# EAGLE design DIY_tool_-_button_panel_v1 (EAGLE 8.0.0)
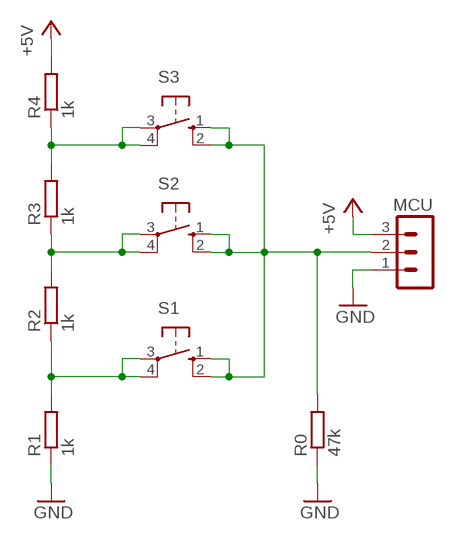
[diagram p0: schematic, sheet 1]

## Parts
MCU  MA03-1  [MA03-1]
R0  47k  R-EU_0207/10  [0207/10]
R1  1k  R-EU_0207/10  [0207/10]
R2  1k  R-EU_0207/10  [0207/10]
R3  1k  R-EU_0207/10  [0207/10]
R4  1k  R-EU_0207/10  [0207/10]
S1  10-XX  [B3F-10XX]
S2  10-XX  [B3F-10XX]
S3  10-XX  [B3F-10XX]

## Nets
+5V: MCU.3 R4.2
ADC: MCU.2 R0.2 S1.1(S) S1.2(S1) S2.1(S) S2.2(S1) S3.1(S) S3.2(S1)
B1: R1.2 R2.1 S1.3(P) S1.4(P1)
B2: R2.2 R3.1 S2.3(P) S2.4(P1)
B3: R3.2 R4.1 S3.3(P) S3.4(P1)
GND: MCU.1 R0.1 R1.1

## Library data of the parts
MCU = con-lstb:MA03-1: PIN HEADER; OC_FARNELL: unknown; OC_NEWARK: unknown
R0 R1-R4 = rcl:R-EU_: RESISTOR, European symbol
S1-S3 = switch-omron:10-XX: OMRON SWITCH; MPN: B3F-1000; OC_FARNELL: 176432; OC_NEWARK: 36M3542

## Board
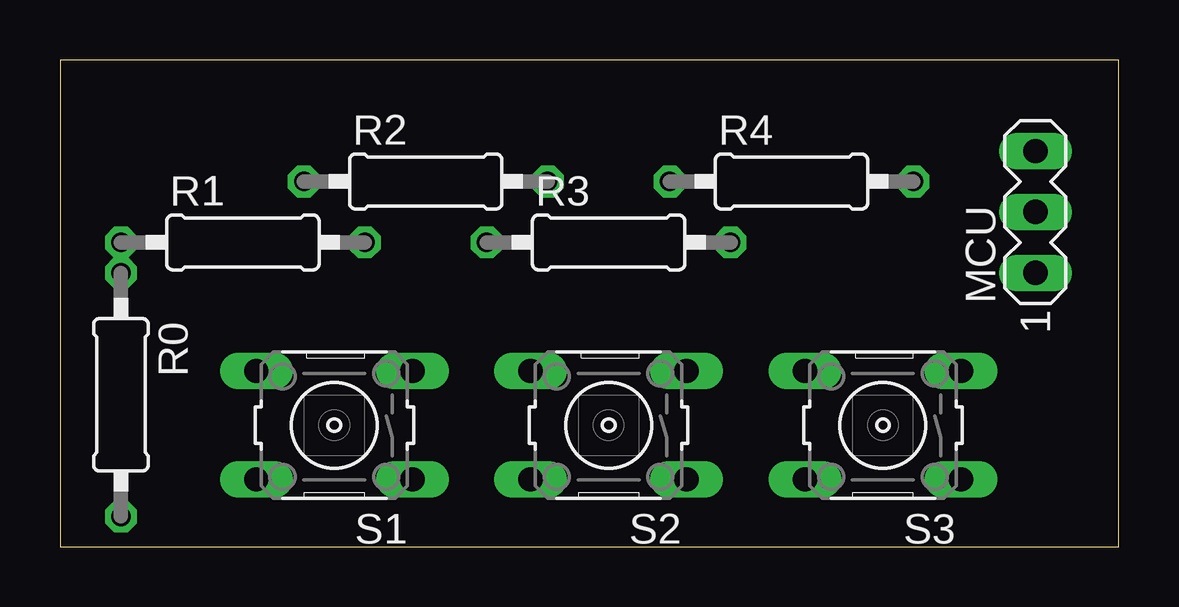
[diagram p1: board, top side]
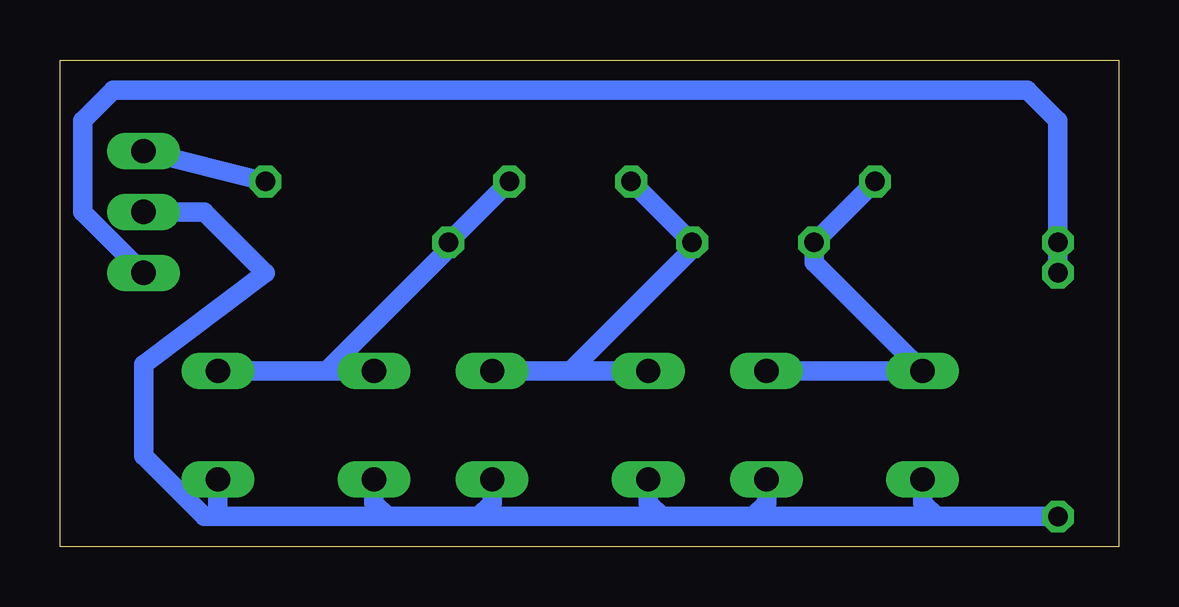
[diagram p2: board, bottom side, seen from below]

Size 44.12 x 20.31 mm. Coordinates in mm from the lower left corner, seen from the top.
Outline: 0,0 44.12,0 44.12,20.31 0,20.31 0,0
Copper layers (1*16): Top 0.035mm / dielectric 1.5mm / Bottom 0.035mm
Design rules "default": minimum track width 10mil, minimum drill 24mil, track to track 8mil, track to pad 8mil, pad to pad 8mil, via to via 8mil, smd to smd 8mil, copper to edge 40mil, drill to drill 8mil, minimum pad ring 10mil, minimum via ring 8mil, stop-mask expansion 4mil, vias tented up to drill 0mil, thermal gap 10mil

### Footprints (pad centres in the part's own frame; a part is rotated, then mirrored left to right if it is on the bottom)
MA03-1 = drill 1.016 long: 1 -2.54,0; 2 0,0; 3 2.54,0
0207/10 = drill 0.813 octagon: 1 -5.08,0; 2 5.08,0
B3F-10XX = drill 1.016 long: 1 -3.251,2.261; 2 3.251,2.261; 3 -3.251,-2.261; 4 3.251,-2.261

### Placement (x,y rotation side)
MCU  40.64,13.97 90 top
R0  2.54,6.35 270 top
R1  7.62,12.7 0 top
R2  15.24,15.24 0 top
R3  22.86,12.7 0 top
R4  30.48,15.24 0 top
S1  11.43,5.08 180 top
S2  22.86,5.08 180 top
S3  34.29,5.08 180 top

### Tracks (layer width: path | path; a pad name or v marks a point on that pad's centre or on a via)
+5V
  Bottom 0.813: MCU.3 R4.2
ADC
  Bottom 0.813: 26.67,1.27 30.48,1.27 | 19.05,1.27 26.67,1.27 | 15.24,1.27 19.05,1.27 | 7.62,1.27 15.24,1.27 | 7.62,1.27 R0.2 | 37.54,1.27 30.48,1.27 | 37.54,1.27 S3.1 | S3.2 31.04,1.83 30.48,1.27 | S2.1 26.11,1.83 26.67,1.27 | S2.2 19.61,1.83 19.05,1.27 | S1.1 14.68,1.83 15.24,1.27 | S1.2 8.18,1.83 7.62,1.27 | MCU.2 38.1,13.97 35.56,11.43 40.64,7.62 40.64,3.81 38.1,1.27 37.54,1.27
B1
  Bottom 0.813: 8.67,7.84 12.7,11.86 R1.2 R2.1 | 8.67,7.84 S1.4 | S1.3 9.17,7.34 8.67,7.84
B2
  Bottom 0.813: 22.86,7.34 S2.3 | 22.86,7.34 S2.4 | 22.86,7.34 17.78,12.42 R3.1 R2.2
B3
  Bottom 0.813: 33.02,7.34 S3.4 | 33.02,7.34 S3.3 | 33.02,7.34 27.94,12.42 R3.2 R4.1
GND
  Bottom 0.813: R0.1 R1.1 2.54,17.78 3.81,19.05 41.91,19.05 43.18,17.78 43.18,13.97 MCU.1